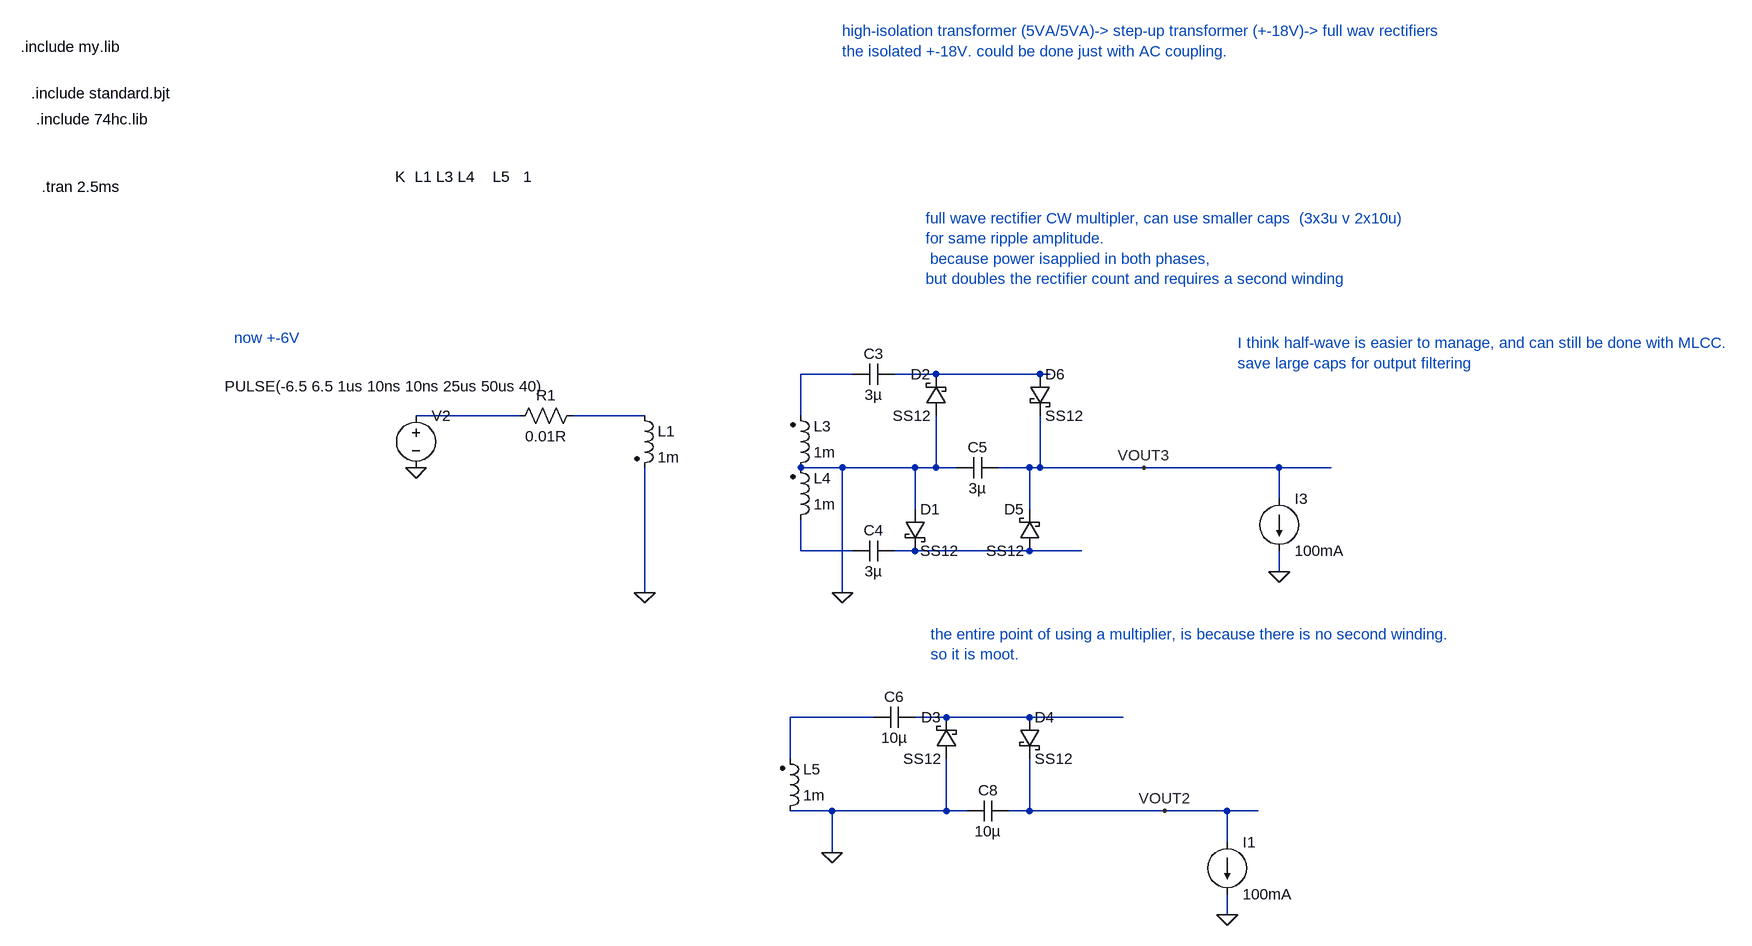
[diagram p0: schematic Draft26.asc]
Draft26.asc, the LTspice schematic file:
Version 4
SHEET 1 5720 1740
WIRE 1824 -192 1744 -192
WIRE 1952 -192 1888 -192
WIRE 2112 -192 1952 -192
WIRE 2128 -192 2112 -192
WIRE 1312 -128 1152 -128
WIRE 1504 -128 1392 -128
WIRE 1744 -128 1744 -192
WIRE 1808 -48 1744 -48
WIRE 1920 -48 1808 -48
WIRE 1952 -48 1952 -128
WIRE 1952 -48 1920 -48
WIRE 1984 -48 1952 -48
WIRE 2096 -48 2048 -48
WIRE 2112 -48 2112 -128
WIRE 2112 -48 2096 -48
WIRE 2272 -48 2112 -48
WIRE 2480 -48 2272 -48
WIRE 2560 -48 2480 -48
WIRE 2480 0 2480 -48
WIRE 1920 16 1920 -48
WIRE 2096 16 2096 -48
WIRE 1744 80 1744 32
WIRE 1824 80 1744 80
WIRE 1920 80 1888 80
WIRE 2096 80 1920 80
WIRE 2176 80 2096 80
WIRE 2480 112 2480 80
WIRE 1504 144 1504 -48
WIRE 1808 144 1808 -48
WIRE 1856 336 1728 336
WIRE 1968 336 1920 336
WIRE 2096 336 1968 336
WIRE 2240 336 2096 336
WIRE 1728 400 1728 336
WIRE 1792 480 1728 480
WIRE 1968 480 1968 400
WIRE 1968 480 1792 480
WIRE 2000 480 1968 480
WIRE 2096 480 2096 400
WIRE 2096 480 2064 480
WIRE 2304 480 2096 480
WIRE 2400 480 2304 480
WIRE 2448 480 2400 480
WIRE 2400 528 2400 480
WIRE 1792 544 1792 480
WIRE 2400 640 2400 608
FLAG 1808 144 0
FLAG 1152 -48 0
FLAG 1504 144 0
FLAG 1792 544 0
FLAG 2304 480 VOUT2
FLAG 2272 -48 VOUT3
FLAG 2400 640 0
FLAG 2480 112 0
SYMBOL ind2 1728 -32 M180
WINDOW 0 36 80 Left 2
WINDOW 3 36 40 Left 2
SYMATTR InstName L3
SYMATTR Value 1m
SYMATTR Type ind
SYMBOL ind2 1728 48 M180
WINDOW 0 36 80 Left 2
WINDOW 3 36 40 Left 2
SYMATTR InstName L4
SYMATTR Value 1m
SYMATTR Type ind
SYMBOL ind2 1488 -144 R0
SYMATTR InstName L1
SYMATTR Value 1m
SYMATTR Type ind
SYMBOL voltage 1152 -144 R0
WINDOW 123 0 0 Left 0
WINDOW 39 0 0 Left 0
WINDOW 3 -294 -29 Left 2
SYMATTR Value PULSE(-6.5 6.5 1us 10ns 10ns 25us 50us 40)
SYMATTR InstName V2
SYMBOL res 1408 -144 R90
WINDOW 0 0 56 VBottom 2
WINDOW 3 32 56 VTop 2
SYMATTR InstName R1
SYMATTR Value 0.01R
SYMBOL cap 1888 -208 R90
WINDOW 0 0 32 VBottom 2
WINDOW 3 32 32 VTop 2
SYMATTR InstName C3
SYMATTR Value 3µ
SYMBOL cap 1888 64 R90
WINDOW 0 0 32 VBottom 2
WINDOW 3 32 32 VTop 2
SYMATTR InstName C4
SYMATTR Value 3µ
SYMBOL cap 1984 -32 R270
WINDOW 0 32 32 VTop 2
WINDOW 3 0 32 VBottom 2
SYMATTR InstName C5
SYMATTR Value 3µ
SYMBOL ind2 1712 496 M180
WINDOW 0 36 80 Left 2
WINDOW 3 36 40 Left 2
SYMATTR InstName L5
SYMATTR Value 1m
SYMATTR Type ind
SYMBOL schottky 1984 400 R180
WINDOW 0 24 64 Left 2
WINDOW 3 24 0 Left 2
SYMATTR InstName D3
SYMATTR Value SS12
SYMATTR Description Diode
SYMATTR Type diode
SYMBOL cap 1920 320 R90
WINDOW 0 0 32 VBottom 2
WINDOW 3 32 32 VTop 2
SYMATTR InstName C6
SYMATTR Value 10µ
SYMBOL cap 2000 496 R270
WINDOW 0 32 32 VTop 2
WINDOW 3 0 32 VBottom 2
SYMATTR InstName C8
SYMATTR Value 10µ
SYMBOL schottky 2080 336 R0
SYMATTR InstName D4
SYMATTR Value SS12
SYMATTR Description Diode
SYMATTR Type diode
SYMBOL current 2400 528 R0
WINDOW 123 0 0 Left 0
WINDOW 39 0 0 Left 0
SYMATTR InstName I1
SYMATTR Value 100mA
SYMBOL current 2480 0 R0
WINDOW 123 0 0 Left 0
WINDOW 39 0 0 Left 0
SYMATTR InstName I3
SYMATTR Value 100mA
SYMBOL schottky 1968 -128 R180
WINDOW 0 24 64 Left 2
WINDOW 3 24 0 Left 2
SYMATTR InstName D2
SYMATTR Value SS12
SYMATTR Description Diode
SYMATTR Type diode
SYMBOL schottky 2112 80 R180
WINDOW 0 24 64 Left 2
WINDOW 3 24 0 Left 2
SYMATTR InstName D5
SYMATTR Value SS12
SYMATTR Description Diode
SYMATTR Type diode
SYMBOL schottky 1904 16 R0
SYMATTR InstName D1
SYMATTR Value SS12
SYMATTR Description Diode
SYMATTR Type diode
SYMBOL schottky 2096 -192 R0
SYMATTR InstName D6
SYMATTR Value SS12
SYMATTR Description Diode
SYMATTR Type diode
TEXT 576 -480 Left 2 !.tran 2.5ms
TEXT 1120 -496 Left 2 !K  L1 L3 L4    L5   1
TEXT 560 -624 Left 2 !.include standard.bjt
TEXT 544 -696 Left 2 !.include my.lib
TEXT 568 -584 Left 2 !.include 74hc.lib
TEXT 872 -248 Left 2 ;now +-6V
TEXT 1808 -720 Left 2 ;high-isolation transformer (5VA/5VA)-> step-up transformer (+-18V)-> full wav rectifiers\nthe isolated +-18V. could be done just with AC coupling.
TEXT 1936 -432 Left 2 ;full wave rectifier CW multipler, can use smaller caps  (3x3u v 2x10u)\nfor same ripple amplitude.\n because power isapplied in both phases,\nbut doubles the rectifier count and requires a second winding
TEXT 2416 -240 Left 2 ;I think half-wave is easier to manage, and can still be done with MLCC.\nsave large caps for output filtering
TEXT 1944 208 Left 2 ;the entire point of using a multiplier, is because there is no second winding.\nso it is moot.

The netlist it stands for:
* Draft26.asc
L3 0 N001 1m
L4 N005 0 1m
L1 N004 0 1m
V2 N003 0 PULSE(-6.5 6.5 1us 10ns 10ns 25us 50us 40)
R1 N004 N003 0.01R
C3 N002 N001 3µ
C4 N006 N005 3µ
C5 0 VOUT3 3µ
L5 0 N007 1m
D3 0 N008 SS12
C6 N008 N007 10µ
C8 0 VOUT2 10µ
D4 N008 VOUT2 SS12
I1 VOUT2 0 100mA
I3 VOUT3 0 100mA
D2 0 N002 SS12
D5 N006 VOUT3 SS12
D1 0 N006 SS12
D6 N002 VOUT3 SS12
.model D D
.lib standard.dio
.tran 2.5ms
K  L1 L3 L4    L5   1
.include standard.bjt
.include my.lib
.include 74hc.lib
* now +-6V
* high-isolation transformer (5VA/5VA)-> step-up transformer (+-18V)-> full wav rectifiers
* the isolated +-18V. could be done just with AC coupling.
* full wave rectifier CW multipler, can use smaller caps  (3x3u v 2x10u)
* for same ripple amplitude.
*  because power isapplied in both phases,
* but doubles the rectifier count and requires a second winding
* I think half-wave is easier to manage, and can still be done with MLCC.
* save large caps for output filtering
* the entire point of using a multiplier, is because there is no second winding.
* so it is moot.
.backanno
.end